# EAGLE design teensyShield1.9 (EAGLE 7.7.0)
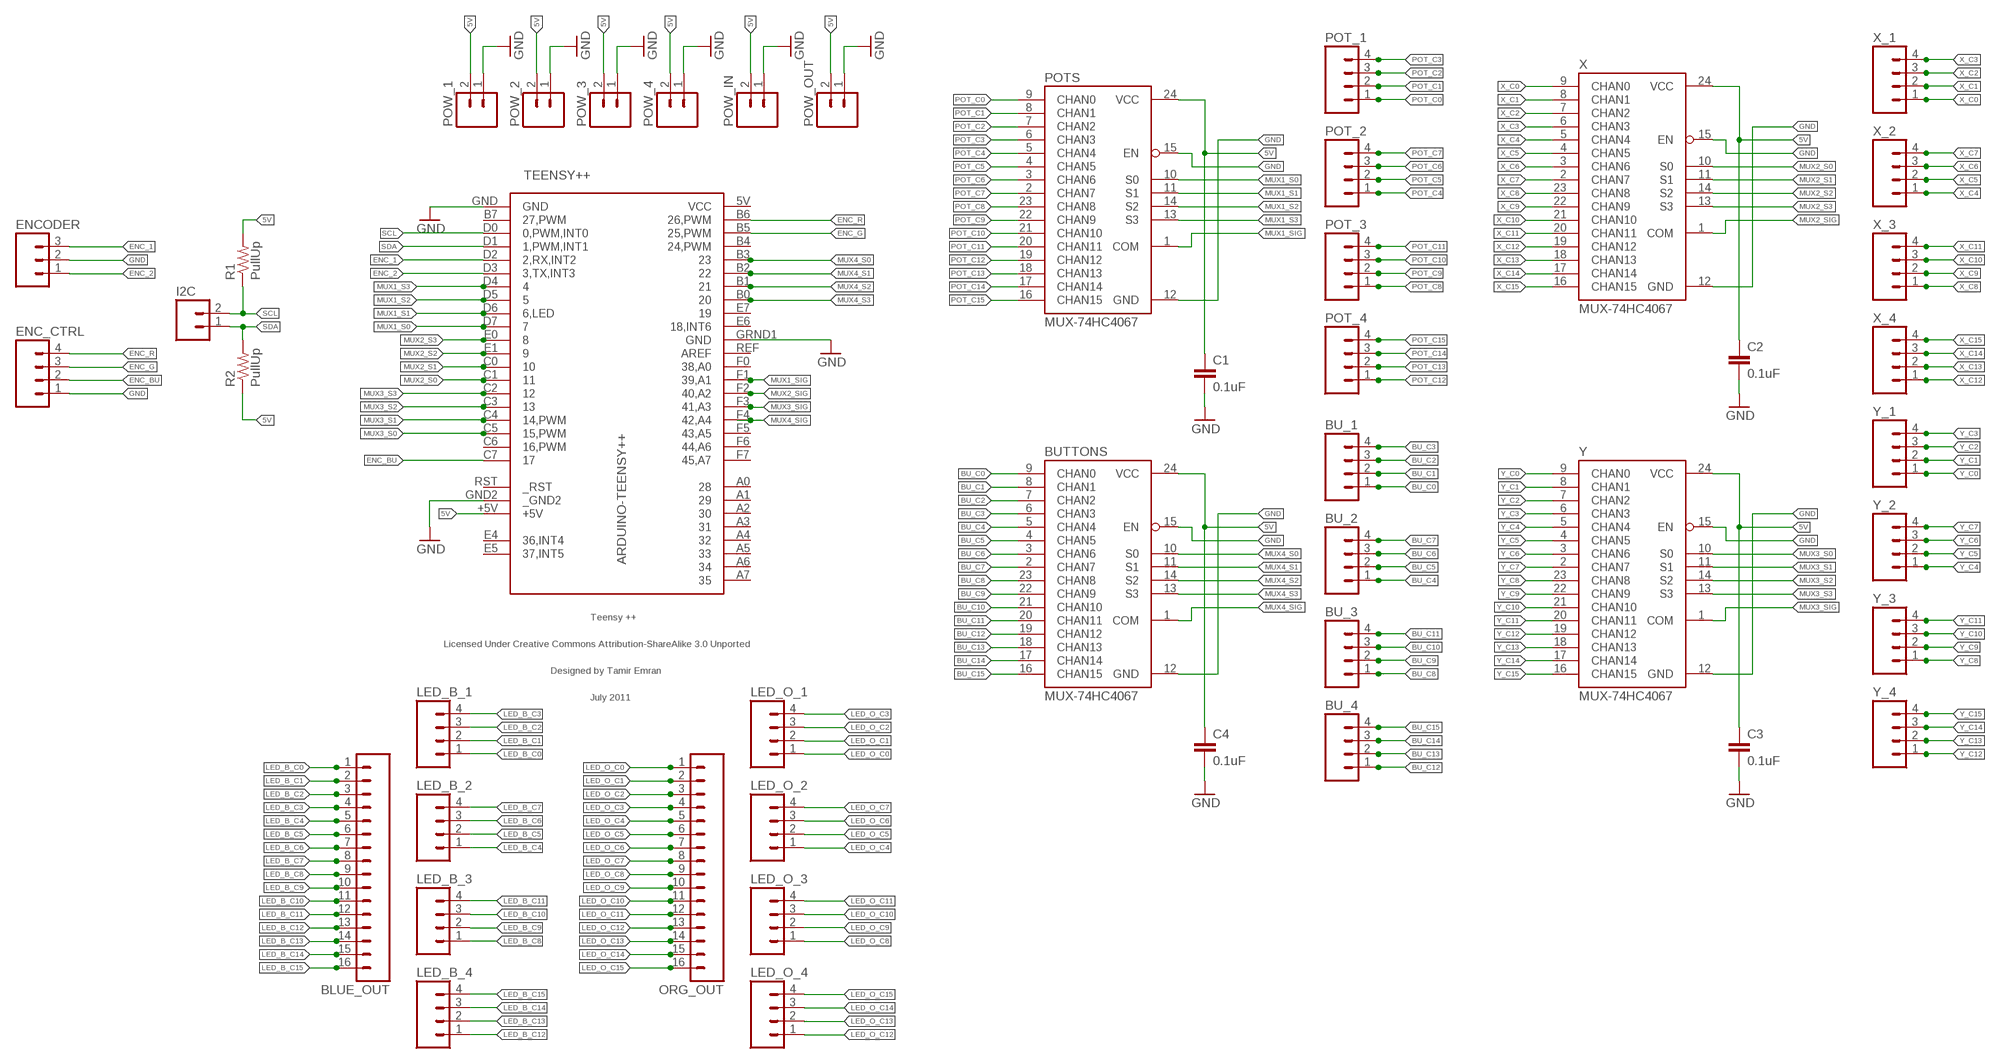
[diagram p0: schematic, sheet 1]

## Parts
BLUE_OUT  M161X16_NO_SILK  [1X16_NO_SILK]
BU_1  M04NO_SILK_ALL_ROUND  [1X04_NO_SILK_ALL_ROUND]
BU_2  M04NO_SILK_ALL_ROUND  [1X04_NO_SILK_ALL_ROUND]
BU_3  M04NO_SILK_ALL_ROUND  [1X04_NO_SILK_ALL_ROUND]
BU_4  M04NO_SILK_ALL_ROUND  [1X04_NO_SILK_ALL_ROUND]
BUTTONS  MUX-74HC4067  MUX-74HC4067SMD  [SSOP24]
C1  0.1uF  CAP0603  [0603]
C2  0.1uF  CAP0603  [0603]
C3  0.1uF  CAP0603  [0603]
C4  0.1uF  CAP0603  [0603]
ENC_CTRL  M041X04_NO_SILK  [1X04_NO_SILK]
ENCODER  M031X03_NO_SILK  [1X03_NO_SILK]
I2C  M02LOCK  [1X02_LOCK]
LED_B_1  M04NO_SILK_ALL_ROUND  [1X04_NO_SILK_ALL_ROUND]
LED_B_2  M04NO_SILK_ALL_ROUND  [1X04_NO_SILK_ALL_ROUND]
LED_B_3  M04NO_SILK_ALL_ROUND  [1X04_NO_SILK_ALL_ROUND]
LED_B_4  M04NO_SILK_ALL_ROUND  [1X04_NO_SILK_ALL_ROUND]
LED_O_1  M04NO_SILK_ALL_ROUND  [1X04_NO_SILK_ALL_ROUND]
LED_O_2  M04NO_SILK_ALL_ROUND  [1X04_NO_SILK_ALL_ROUND]
LED_O_3  M04NO_SILK_ALL_ROUND  [1X04_NO_SILK_ALL_ROUND]
LED_O_4  M04NO_SILK_ALL_ROUND  [1X04_NO_SILK_ALL_ROUND]
ORG_OUT  M161X16_NO_SILK  [1X16_NO_SILK]
POT_1  M04NO_SILK_ALL_ROUND  [1X04_NO_SILK_ALL_ROUND]
POT_2  M04NO_SILK_ALL_ROUND  [1X04_NO_SILK_ALL_ROUND]
POT_3  M04NO_SILK_ALL_ROUND  [1X04_NO_SILK_ALL_ROUND]
POT_4  M04NO_SILK_ALL_ROUND  [1X04_NO_SILK_ALL_ROUND]
POTS  MUX-74HC4067  MUX-74HC4067SMD  [SSOP24]
POW_1  M02POLAR  [MOLEX-1X2]
POW_2  M02POLAR  [MOLEX-1X2]
POW_3  M02POLAR  [MOLEX-1X2]
POW_4  M02POLAR  [MOLEX-1X2]
POW_IN  M02POLAR  [MOLEX-1X2]
POW_OUT  M02POLAR  [MOLEX-1X2]
R1  PullUp  10KOHM-1/4W5%(PTH)  [AXIAL-0.3]
R2  PullUp  10KOHM-1/4W5%(PTH)  [AXIAL-0.3]
TEENSY++  ARDUINO-TEENSY++  [TEENSY++]
X  MUX-74HC4067  MUX-74HC4067SMD  [SSOP24]
X_1  M04NO_SILK_ALL_ROUND  [1X04_NO_SILK_ALL_ROUND]
X_2  M04NO_SILK_ALL_ROUND  [1X04_NO_SILK_ALL_ROUND]
X_3  M04NO_SILK_ALL_ROUND  [1X04_NO_SILK_ALL_ROUND]
X_4  M04NO_SILK_ALL_ROUND  [1X04_NO_SILK_ALL_ROUND]
Y  MUX-74HC4067  MUX-74HC4067SMD  [SSOP24]
Y_1  M04NO_SILK_ALL_ROUND  [1X04_NO_SILK_ALL_ROUND]
Y_2  M04NO_SILK_ALL_ROUND  [1X04_NO_SILK_ALL_ROUND]
Y_3  M04NO_SILK_ALL_ROUND  [1X04_NO_SILK_ALL_ROUND]
Y_4  M04NO_SILK_ALL_ROUND  [1X04_NO_SILK_ALL_ROUND]

## Nets
5V: BUTTONS.24(VCC) C1.1 C2.1 C3.1 C4.1 POTS.24(VCC) POW_1.2 POW_2.2 POW_3.2 POW_4.2 POW_IN.2 POW_OUT.2 R1.P$2 R2.P$1 TEENSY++.+5V X.24(VCC) Y.24(VCC)
BU_C0: BU_1.1 BUTTONS.9(CHAN0)
BU_C1: BU_1.2 BUTTONS.8(CHAN1)
BU_C2: BU_1.3 BUTTONS.7(CHAN2)
BU_C3: BU_1.4 BUTTONS.6(CHAN3)
BU_C4: BU_2.1 BUTTONS.5(CHAN4)
BU_C5: BU_2.2 BUTTONS.4(CHAN5)
BU_C6: BU_2.3 BUTTONS.3(CHAN6)
BU_C7: BU_2.4 BUTTONS.2(CHAN7)
BU_C8: BU_3.1 BUTTONS.23(CHAN8)
BU_C9: BU_3.2 BUTTONS.22(CHAN9)
BU_C10: BU_3.3 BUTTONS.21(CHAN10)
BU_C11: BU_3.4 BUTTONS.20(CHAN11)
BU_C12: BU_4.1 BUTTONS.19(CHAN12)
BU_C13: BU_4.2 BUTTONS.18(CHAN13)
BU_C14: BU_4.3 BUTTONS.17(CHAN14)
BU_C15: BU_4.4 BUTTONS.16(CHAN15)
ENC_1: ENCODER.3 TEENSY++.D2(2,RX,INT2)
ENC_2: ENCODER.1 TEENSY++.D3(3,TX,INT3)
ENC_BU: ENC_CTRL.2 TEENSY++.C7
ENC_G: ENC_CTRL.3 TEENSY++.B5(25,PWM)
ENC_R: ENC_CTRL.4 TEENSY++.B6(26,PWM)
GND: BUTTONS.12(GND) BUTTONS.15(EN) C1.2 C2.2 C3.2 C4.2 ENC_CTRL.1 ENCODER.2 POTS.12(GND) POTS.15(EN) POW_1.1 POW_2.1 POW_3.1 POW_4.1 POW_IN.1 POW_OUT.1 TEENSY++.GND TEENSY++.GND2(_GND2) TEENSY++.GRND1(GND) X.12(GND) X.15(EN) Y.12(GND) Y.15(EN)
LED_B_C0: BLUE_OUT.1 LED_B_1.1
LED_B_C1: BLUE_OUT.2 LED_B_1.2
LED_B_C2: BLUE_OUT.3 LED_B_1.3
LED_B_C3: BLUE_OUT.4 LED_B_1.4
LED_B_C4: BLUE_OUT.5 LED_B_2.1
LED_B_C5: BLUE_OUT.6 LED_B_2.2
LED_B_C6: BLUE_OUT.7 LED_B_2.3
LED_B_C7: BLUE_OUT.8 LED_B_2.4
LED_B_C8: BLUE_OUT.9 LED_B_3.1
LED_B_C9: BLUE_OUT.10 LED_B_3.2
LED_B_C10: BLUE_OUT.11 LED_B_3.3
LED_B_C11: BLUE_OUT.12 LED_B_3.4
LED_B_C12: BLUE_OUT.13 LED_B_4.1
LED_B_C13: BLUE_OUT.14 LED_B_4.2
LED_B_C14: BLUE_OUT.15 LED_B_4.3
LED_B_C15: BLUE_OUT.16 LED_B_4.4
LED_O_C0: LED_O_1.1 ORG_OUT.1
LED_O_C1: LED_O_1.2 ORG_OUT.2
LED_O_C2: LED_O_1.3 ORG_OUT.3
LED_O_C3: LED_O_1.4 ORG_OUT.4
LED_O_C4: LED_O_2.1 ORG_OUT.5
LED_O_C5: LED_O_2.2 ORG_OUT.6
LED_O_C6: LED_O_2.3 ORG_OUT.7
LED_O_C7: LED_O_2.4 ORG_OUT.8
LED_O_C8: LED_O_3.1 ORG_OUT.9
LED_O_C9: LED_O_3.2 ORG_OUT.10
LED_O_C10: LED_O_3.3 ORG_OUT.11
LED_O_C11: LED_O_3.4 ORG_OUT.12
LED_O_C12: LED_O_4.1 ORG_OUT.13
LED_O_C13: LED_O_4.2 ORG_OUT.14
LED_O_C14: LED_O_4.3 ORG_OUT.15
LED_O_C15: LED_O_4.4 ORG_OUT.16
MUX1_S0: POTS.10(S0) TEENSY++.D7
MUX1_S1: POTS.11(S1) TEENSY++.D6(6,LED)
MUX1_S2: POTS.14(S2) TEENSY++.D5
MUX1_S3: POTS.13(S3) TEENSY++.D4
MUX1_SIG: POTS.1(COM) TEENSY++.F1(39,A1)
MUX2_S0: TEENSY++.C1 X.10(S0)
MUX2_S1: TEENSY++.C0 X.11(S1)
MUX2_S2: TEENSY++.E1 X.14(S2)
MUX2_S3: TEENSY++.E0 X.13(S3)
MUX2_SIG: TEENSY++.F2(40,A2) X.1(COM)
MUX3_S0: TEENSY++.C5(15,PWM) Y.10(S0)
MUX3_S1: TEENSY++.C4(14,PWM) Y.11(S1)
MUX3_S2: TEENSY++.C3 Y.14(S2)
MUX3_S3: TEENSY++.C2 Y.13(S3)
MUX3_SIG: TEENSY++.F3(41,A3) Y.1(COM)
MUX4_S0: BUTTONS.10(S0) TEENSY++.B3
MUX4_S1: BUTTONS.11(S1) TEENSY++.B2
MUX4_S2: BUTTONS.14(S2) TEENSY++.B1
MUX4_S3: BUTTONS.13(S3) TEENSY++.B0
MUX4_SIG: BUTTONS.1(COM) TEENSY++.F4(42,A4)
POT_C0: POT_1.1 POTS.9(CHAN0)
POT_C1: POT_1.2 POTS.8(CHAN1)
POT_C2: POT_1.3 POTS.7(CHAN2)
POT_C3: POT_1.4 POTS.6(CHAN3)
POT_C4: POT_2.1 POTS.5(CHAN4)
POT_C5: POT_2.2 POTS.4(CHAN5)
POT_C6: POT_2.3 POTS.3(CHAN6)
POT_C7: POT_2.4 POTS.2(CHAN7)
POT_C8: POT_3.1 POTS.23(CHAN8)
POT_C9: POT_3.2 POTS.22(CHAN9)
POT_C10: POT_3.3 POTS.21(CHAN10)
POT_C11: POT_3.4 POTS.20(CHAN11)
POT_C12: POT_4.1 POTS.19(CHAN12)
POT_C13: POT_4.2 POTS.18(CHAN13)
POT_C14: POT_4.3 POTS.17(CHAN14)
POT_C15: POT_4.4 POTS.16(CHAN15)
SCL: I2C.2 R1.P$1 TEENSY++.D0(0,PWM,INT0)
SDA: I2C.1 R2.P$2 TEENSY++.D1(1,PWM,INT1)
X_C0: X.9(CHAN0) X_1.1
X_C1: X.8(CHAN1) X_1.2
X_C2: X.7(CHAN2) X_1.3
X_C3: X.6(CHAN3) X_1.4
X_C4: X.5(CHAN4) X_2.1
X_C5: X.4(CHAN5) X_2.2
X_C6: X.3(CHAN6) X_2.3
X_C7: X.2(CHAN7) X_2.4
X_C8: X.23(CHAN8) X_3.1
X_C9: X.22(CHAN9) X_3.2
X_C10: X.21(CHAN10) X_3.3
X_C11: X.20(CHAN11) X_3.4
X_C12: X.19(CHAN12) X_4.1
X_C13: X.18(CHAN13) X_4.2
X_C14: X.17(CHAN14) X_4.3
X_C15: X.16(CHAN15) X_4.4
Y_C0: Y.9(CHAN0) Y_1.1
Y_C1: Y.8(CHAN1) Y_1.2
Y_C2: Y.7(CHAN2) Y_1.3
Y_C3: Y.6(CHAN3) Y_1.4
Y_C4: Y.5(CHAN4) Y_2.1
Y_C5: Y.4(CHAN5) Y_2.2
Y_C6: Y.3(CHAN6) Y_2.3
Y_C7: Y.2(CHAN7) Y_2.4
Y_C8: Y.23(CHAN8) Y_3.1
Y_C9: Y.22(CHAN9) Y_3.2
Y_C10: Y.21(CHAN10) Y_3.3
Y_C11: Y.20(CHAN11) Y_3.4
Y_C12: Y.19(CHAN12) Y_4.1
Y_C13: Y.18(CHAN13) Y_4.2
Y_C14: Y.17(CHAN14) Y_4.3
Y_C15: Y.16(CHAN15) Y_4.4
Unconnected: TEENSY++.A0 TEENSY++.A1 TEENSY++.A2 TEENSY++.A3 TEENSY++.A4 TEENSY++.A5 TEENSY++.A6 TEENSY++.A7 TEENSY++.B4(24,PWM) TEENSY++.B7(27,PWM) TEENSY++.C6(16,PWM) TEENSY++.E4(36,INT4) TEENSY++.E5(37,INT5) TEENSY++.E6(18,INT6) TEENSY++.E7 TEENSY++.F0(38,A0) TEENSY++.F5(43,A5) TEENSY++.F6(44,A6) TEENSY++.F7(45,A7) TEENSY++.REF(AREF) TEENSY++.RST(_RST)

## Power pins joined to a net without a drawn wire
VCC: TEENSY++.5V(VCC)

## Library data of the parts
BLUE_OUT ORG_OUT = SparkFun-Connectors:M16: 1x16 .1" header
BU_1-BU_4 ENC_CTRL LED_B_1-LED_B_4 LED_O_1-LED_O_4 POT_1-POT_4 X_1-X_4 Y_1-Y_4 = SparkFun-Connectors:M04: Header 4 Standard 4-pin 0.1" header. Use with straight break away headers (SKU : PRT-00116), right angle break away headers (PRT-00553), swiss pins (PRT-00743), machine pins (PRT-00117), and female headers (PRT-00115). Molex polarized connector foot print use with SKU : PRT-08231 with associated crimp pins and housings. 1MM SMD Version SKU: PRT-10208; PROD_ID: CONN-09696
BUTTONS POTS X Y = SparkFun:MUX-74HC4067
C1-C4 = SparkFun:CAP: Capacitor Standard 0603 ceramic capacitor, and 0.1" leaded capacitor.
ENCODER = SparkFun-Connectors:M03: Header 3 Standard 3-pin 0.1" header. Use with straight break away headers (SKU : PRT-00116), right angle break away headers (PRT-00553), swiss pins (PRT-00743), machine pins (PRT-00117), and female headers (PRT-00115). Molex polarized connector foot print use with SKU : PRT-08232 with associated crimp pins and housings.
I2C POW_1-POW_4 POW_IN POW_OUT = SparkFun-Connectors:M02: Standard 2-pin 0.1" header. Use with - straight break away headers ( PRT-00116) - right angle break away headers (PRT-00553) - swiss pins (PRT-00743) - machine pins (PRT-00117) - female headers (PRT-00115) Molex polarized connector foot print use with: PRT-08233 with associated crimp pins and housings. 2.54_SCREWTERM for use with PRT-10571. 3.5mm Screw Terminal footprints for PRT-08084 5mm Screw Terminal footprints for use with PRT-08432
R1 R2 = SparkFun-Resistors:10KOHM-1/4W5%(PTH): RES-09435; PROD_ID: RES-9435; VALUE: 10k
TEENSY++ = teensypp:ARDUINO-TEENSY++: Teensy ++ Original Design by Mark Gross Modified Design by Tamir Emran Licensed Under Creative Commons Attribution-ShareAlike 3.0 Unported (CC BY-SA 3.0)

## Board
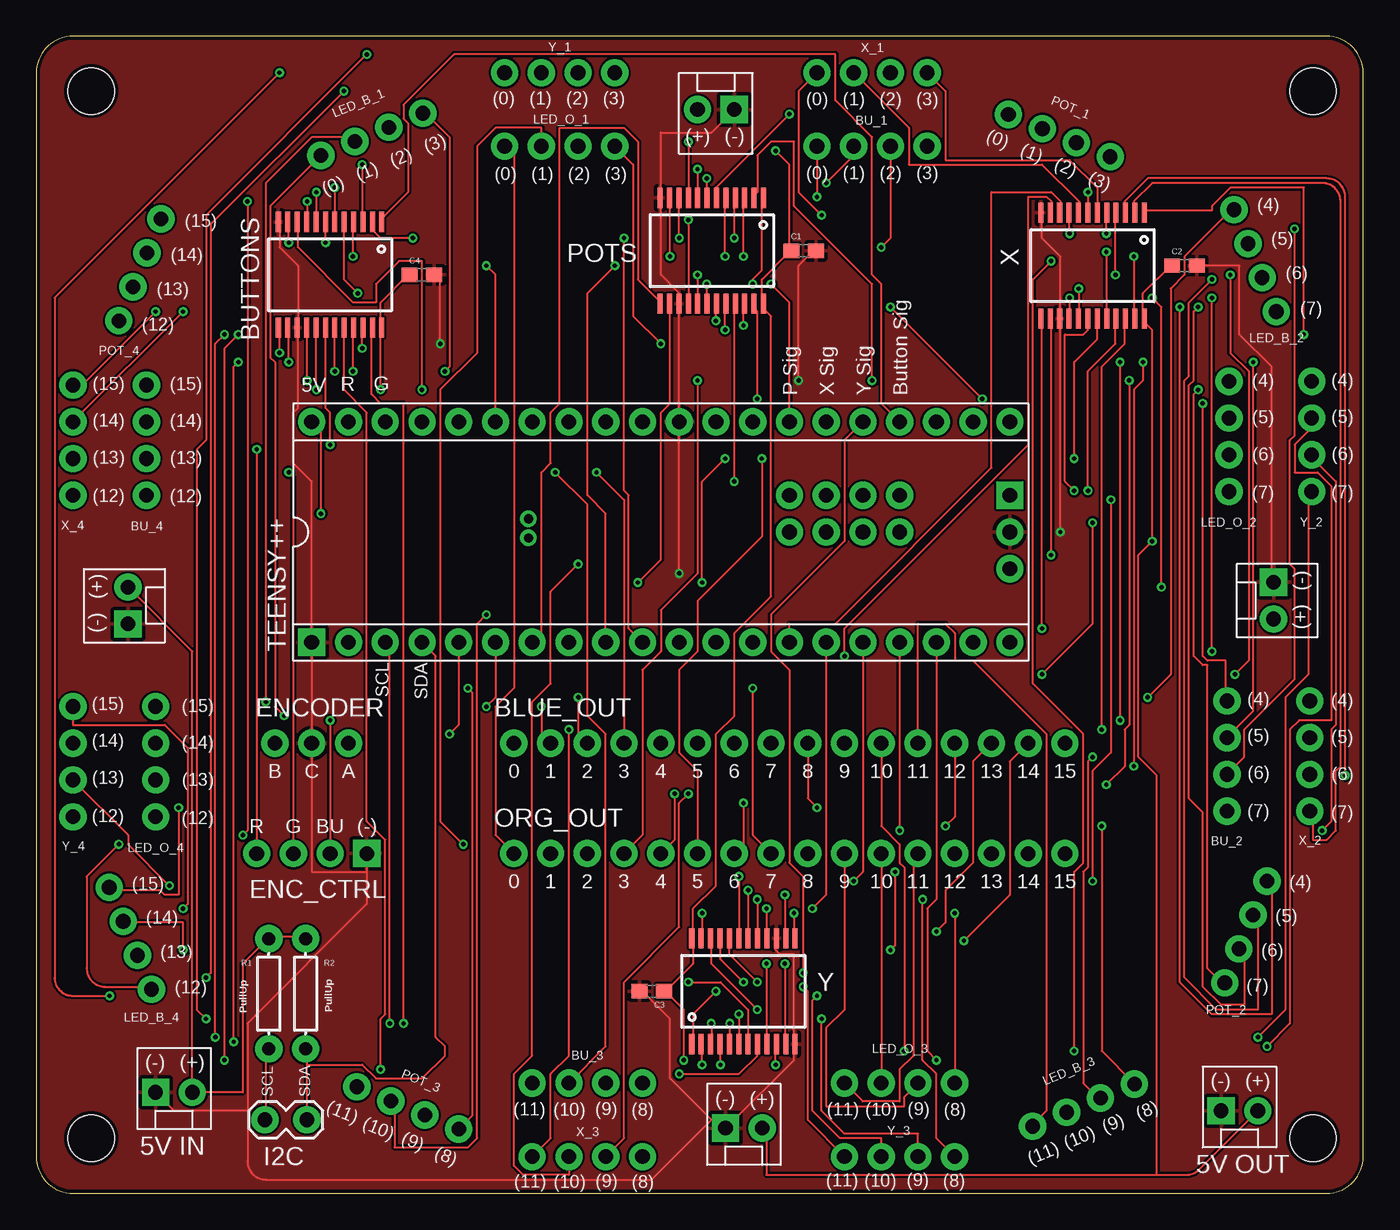
[diagram p1: board, top side]
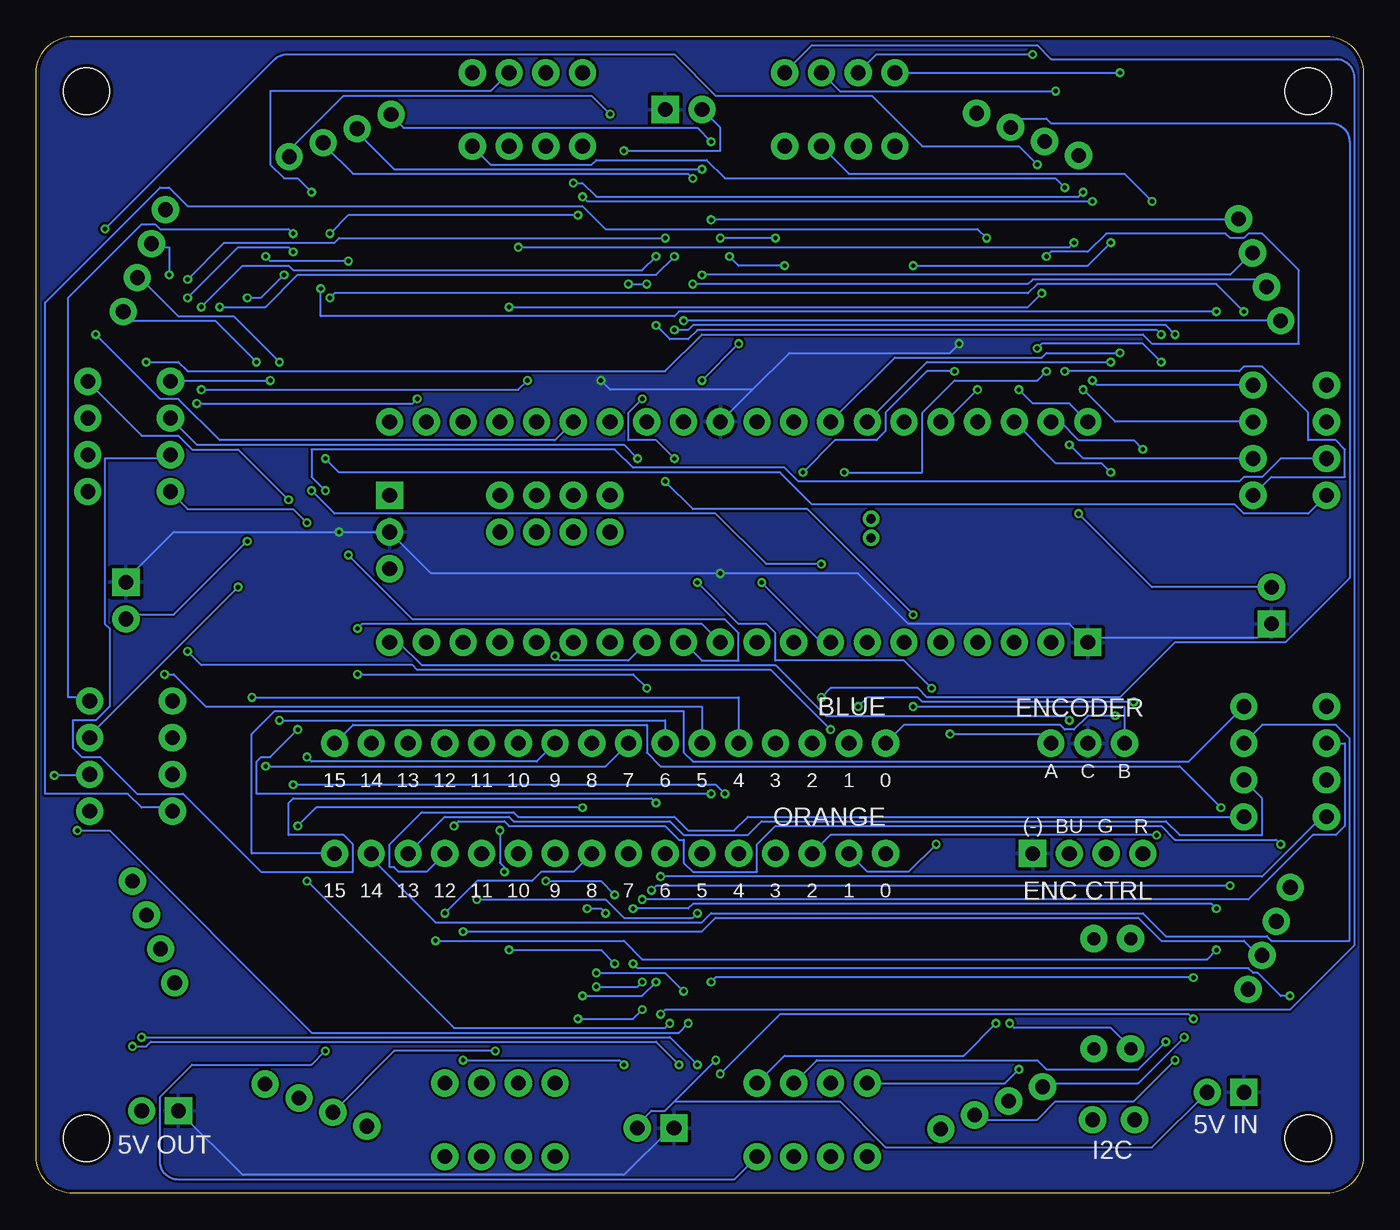
[diagram p2: board, bottom side, seen from below]

Size 91.75 x 80 mm. Coordinates in mm from the lower left corner, seen from the top.
Outline: 2.54,0 89.2,0 arc90 91.75,2.54 91.75,77.46 arc90 89.2,80 2.54,80 arc90 0,77.46 0,2.54 arc90 2.54,0
Copper layers (1*16): Top 0.035mm / dielectric 1.5mm / Bottom 0.035mm
Design rules "SeeedStudio_2layer_DRU_no_angle_20140221": minimum track width 6mil, minimum drill 12mil, track to track 6mil, track to pad 6mil, pad to pad 6mil, via to via 6mil, smd to smd 0mil, copper to edge 10mil, drill to drill 10mil, minimum pad ring 10mil, minimum via ring 6mil, stop-mask expansion 2mil, vias tented up to drill 100mil, thermal gap 10mil
Holes 3.2 mm at 88.27,3.81 88.27,76.2 3.81,76.2 3.81,3.81

### Footprints (pad centres in the part's own frame; a part is rotated, then mirrored left to right if it is on the bottom)
1X16_NO_SILK = drill 1.016 pad 1.88: 1 0,0; 2 2.54,0; 3 5.08,0; 4 7.62,0; 5 10.16,0; 6 12.7,0; 7 15.24,0; 8 17.78,0; 9 20.32,0; 10 22.86,0; 11 25.4,0; 12 27.94,0; 13 30.48,0; 14 33.02,0; 15 35.56,0; 16 38.1,0
1X04_NO_SILK_ALL_ROUND = drill 1.016 pad 1.88: 1 0,0; 2 2.54,0; 3 5.08,0; 4 7.62,0
SSOP24 = smd 0.348 x 1.397: 1 -3.575,-3.656; 2 -2.925,-3.656; 3 -2.275,-3.656; 4 -1.625,-3.656; 5 -0.975,-3.656; 6 -0.325,-3.656; 7 0.325,-3.656; 8 0.975,-3.656; 9 1.625,-3.656; 10 2.275,-3.656; 11 2.925,-3.656; 12 3.575,-3.656; 13 3.575,3.656; 14 2.925,3.656; 15 2.275,3.656; 16 1.625,3.656; 17 0.975,3.656; 18 0.325,3.656; 19 -0.325,3.656; 20 -0.975,3.656; 21 -1.625,3.656; 22 -2.275,3.656; 23 -2.925,3.656; 24 -3.575,3.656
0603 = smd 1.1 x 1: 1 -0.85,0; 2 0.85,0
1X04_NO_SILK = drill 1.016 pad 1.88 square: 1 0,0 | drill 1.016 pad 1.88: 2 2.54,0; 3 5.08,0; 4 7.62,0
1X03_NO_SILK = drill 1.016 pad 1.88: 1 0,0; 2 2.54,0; 3 5.08,0
1X02_LOCK = drill 1.016 pad 1.88: 1 -0.178,0; 2 2.718,0
MOLEX-1X2 = drill 1.016 pad 1.88 square: 1 0,0 | drill 1.016 pad 1.88: 2 2.54,0
AXIAL-0.3 = drill 0.9 pad 1.88: P$1 -3.81,0; P$2 3.81,0
TEENSY++ = drill 1.016 pad 1.88: 5V 24.13,-2.54; +5V -24.13,7.62; A0 8.89,0; A1 11.43,0; A2 13.97,0; A3 16.51,0; A4 8.89,2.54; A5 11.43,2.54; A6 13.97,2.54; A7 16.51,2.54; B0 -6.35,7.62; B1 -8.89,7.62; B2 -11.43,7.62; B3 -13.97,7.62; B4 -16.51,7.62; B5 -19.05,7.62; B6 -21.59,7.62; B7 -21.59,-7.62; C0 6.35,-7.62; C1 8.89,-7.62; C2 11.43,-7.62; C3 13.97,-7.62; C4 16.51,-7.62; C5 19.05,-7.62; C6 21.59,-7.62; C7 24.13,-7.62; D0 -19.05,-7.62; D1 -16.51,-7.62; D2 -13.97,-7.62; D3 -11.43,-7.62; D4 -8.89,-7.62; D5 -6.35,-7.62; D6 -3.81,-7.62; D7 -1.27,-7.62; E0 1.27,-7.62; E1 3.81,-7.62; E6 -1.27,7.62; E7 -3.81,7.62; F0 6.35,7.62; F1 8.89,7.62; F2 11.43,7.62; F3 13.97,7.62; F4 16.51,7.62; F5 19.05,7.62; F6 21.59,7.62; F7 24.13,7.62; GND2 24.13,0; GRND1 1.27,7.62; REF 3.81,7.62 | drill 0.635 pad 1.067: E4 -9.144,0.914; E5 -9.144,-0.406 | drill 1.016 pad 1.88 square: GND -24.13,-7.62; RST 24.13,2.54

### Placement (x,y rotation side)
BLUE_OUT  33.02,31.11 0 top
BU_1  53.98,72.39 0 top
BU_2  82.33,34.04 270 top
BU_3  41.91,7.62 180 top
BU_4  7.62,48.26 90 top
BUTTONS  20.32,63.5 180 top
C1  53.06,65.17 0 top
C2  79.38,64.14 0 top
C3  42.55,13.97 180 top
C4  26.67,63.5 0 top
ENC_CTRL  22.86,23.5 180 top
ENCODER  16.51,31.11 0 top
I2C  18.54,5.09 180 top
LED_B_1  19.68,71.75 22.5 top
LED_B_2  82.81,68 292.5 top
LED_B_3  75.92,7.56 202.5 top
LED_B_4  7.97,14.11 112.5 top
LED_O_1  32.38,72.39 0 top
LED_O_2  82.46,56.13 270 top
LED_O_3  63.5,7.62 180 top
LED_O_4  8.26,26.04 90 top
ORG_OUT  33.02,23.5 0 top
POT_1  67.21,74.58 337.5 top
POT_2  85.09,21.59 247.5 top
POT_3  29.21,4.45 157.5 top
POT_4  5.71,60.33 67.5 top
POTS  46.71,65.17 180 top
POW_1  6.35,39.37 90 top
POW_2  48.26,74.93 180 top
POW_3  85.54,42.25 270 top
POW_4  47.65,4.52 0 top
POW_IN  8.26,6.99 0 top
POW_OUT  81.92,5.71 0 top
R1  16.09,13.8 90 top
R2  18.63,13.8 270 top
TEENSY++  43.18,45.72 0 top
X  73.03,64.14 180 top
X_1  53.98,77.47 0 top
X_2  88.04,34.04 270 top
X_3  41.91,2.54 180 top
X_4  2.54,48.26 90 top
Y  48.9,13.97 0 top
Y_1  32.38,77.47 0 top
Y_2  88.17,56.13 270 top
Y_3  63.5,2.54 180 top
Y_4  2.54,26.04 90 top

### Tracks (layer width: path | path; a pad name or v marks a point on that pad's centre or on a via)
5V  (via drill 0.3)
  Top 0.152: C4.1 25.72,63.5 23.81,61.59 23.81,60.01 BUTTONS.24 23.81,59.69 v23.81,55.56 | R2.P$1 18.41,17.78 16.19,17.78 R1.P$2 15.88,17.46 14.29,15.88 14.29,6.99 POW_IN.2 10.79,37.47 POW_1.2 | TEENSY++.+5V 19.68,52.7 v19.68,46.99 | C2.1 78.42,64.14 76.52,62.23 76.52,60.64 X.24 76.52,60.33 77.15,59.69 v77.15,45.09 76.2,44.13 76.2,30.16 77.47,28.89 77.47,1.27 | 43.5,13.97 45.4,15.88 45.4,17.46 Y.24 45.4,17.78 45.4,19.68 46.99,21.27 46.99,31.75 48.26,33.02 48.26,38.73 50.8,41.27 50.8,60.64 50.16,61.28 POTS.24 50.16,61.59 50.16,63.18 52.07,65.09 C1.1 52.07,65.41 52.07,71.12 v51.12,72.07 | 43.5,13.97 44.77,12.7 v44.77,9.21 | 43.5,13.97 C3.1 | 77.47,1.27 79.48,1.27 arc45 80.38,1.64 POW_OUT.2 | 77.47,1.27 50.48,1.27 50.48,4.45 POW_4.2
  Bottom 0.152: v23.81,55.56 22.86,54.61 20.32,54.61 TEENSY++.+5V | v19.68,46.99 14.61,41.91 POW_1.2 | v77.15,45.09 82.23,40.01 85.41,40.01 POW_3.2 | 47.62,6.35 48.26,5.71 49.21,5.71 50.16,4.76 POW_4.2 | 47.62,6.35 v44.77,9.21 | POW_2.2 44.45,73.66 44.45,72.07 v51.12,72.07 | POW_IN.2 14.61,3.17 33.02,3.17 36.2,6.35 47.62,6.35
BU_C0  (via drill 0.3)
  Top 0.152: v18.73,68.58 18.73,67.31 BUTTONS.9 | BU_1.1 v53.98,68.9
  Bottom 0.152: v18.73,68.58 53.66,68.58 v53.98,68.9
BU_C1  (via drill 0.3)
  Top 0.152: v19.37,69.22 19.37,67.31 BUTTONS.8 | v54.61,69.85 56.52,71.75 BU_1.2
  Bottom 0.152: v19.37,69.22 19.68,68.9 53.02,68.9 53.98,69.85 v54.61,69.85
BU_C2  (via drill 0.3)
  Top 0.152: v20,65.72 20,66.99 BUTTONS.7 | v58.42,65.41 59.05,66.04 BU_1.3
  Bottom 0.152: v20,65.72 20.32,65.41 v58.42,65.41
BU_C3  (via drill 0.3)
  Top 0.152: v20.64,69.53 20.64,67.31 BUTTONS.6
  Bottom 0.152: v20.64,69.53 21.27,70.17 44.13,70.17 45.4,71.44 53.02,71.44 53.34,71.12 60.33,71.12 BU_1.4
BU_C4  (via drill 0.3)
  Top 0.152: v22.23,62.23 21.27,63.18 21.27,66.99 BUTTONS.5 | v65.41,54.93 v59.05,61.28 | v80.64,54.61 80.64,37.15 80.96,36.83 82.23,36.83 82.23,34.29 BU_2.1
  Bottom 0.152: v22.23,62.23 23.18,61.28 v59.05,61.28 | v65.41,54.93 65.72,54.61 v80.64,54.61
BU_C5  (via drill 0.3)
  Top 0.152: v21.91,64.77 21.91,66.99 BUTTONS.4 | v84.14,57.47 84.14,33.34 82.55,31.75 BU_2.2
  Bottom 0.152: v21.91,64.77 21.59,65.09 19.05,65.09 17.78,66.36 9.53,66.36 9.21,66.04 8.26,66.04 7.94,66.36 6.99,66.36 4.45,63.82 4.45,58.74 14.61,58.74 15.24,59.37 45.72,59.37 48.26,56.83 81.28,56.83 81.92,57.47 v84.14,57.47
BU_C6  (via drill 0.3)
  Top 0.152: v22.54,71.12 22.54,67.31 BUTTONS.3 | v87,66.67 87,52.39 86.68,52.07 86.68,43.5 87,43.18 87,35.56 83.5,32.07 83.5,30.16 82.55,29.21 BU_2.3
  Bottom 0.152: v22.54,71.12 23.81,72.39 30.48,72.39 33.97,75.88 44.77,75.88 47.62,78.74 74.4,78.74 arc-45 75.3,78.37 v87,66.67
BU_C7  (via drill 0.3)
  Top 0.152: v26.04,66.04 23.81,66.04 23.18,66.67 23.18,66.99 BUTTONS.2
  Bottom 0.152: v26.04,66.04 26.67,66.67 52.39,66.67 53.98,68.26 81.28,68.26 82.55,69.53 83.19,69.53 91.12,61.59 91.12,27.62 85.41,27.62 84.45,26.67 82.55,26.67 BU_2.4
BU_C8  (via drill 0.3)
  Top 0.152: v25.4,11.75 25.4,54.61 23.81,54.61 23.18,55.24 23.18,59.69 BUTTONS.23
  Bottom 0.152: v25.4,11.75 27.62,9.53 40.01,9.53 BU_3.1
BU_C9  (via drill 0.3)
  Top 0.152: v22.54,58.42 22.54,59.69 BUTTONS.22 | v13.97,57.47 13.65,57.15 v13.65,10.48
  Bottom 0.152: v22.54,58.42 22.23,58.74 15.24,58.74 v13.97,57.47 | v13.65,10.48 15.56,8.57 21.91,8.57 22.54,9.21 37.78,9.21 BU_3.2
BU_C10  (via drill 0.3)
  Top 0.152: v21.91,56.83 21.91,59.69 BUTTONS.21 | v35.88,49.85 38.1,47.62 38.1,33.02 39.37,31.75 39.37,10.16 BU_3.3
  Bottom 0.152: v21.91,56.83 22.54,56.2 28.26,56.2 30.48,53.98 30.48,49.85 v35.88,49.85
BU_C11  (via drill 0.3)
  Top 0.152: v23.81,8.57 23.81,12.06 24.13,12.38 24.13,24.45 22.86,25.72 22.86,53.98 21.27,55.56 21.27,59.69 BUTTONS.20
  Bottom 0.152: v23.81,8.57 24.77,7.62 BU_3.4
BU_C12  (via drill 0.3)
  Top 0.152: v20.64,56.83 20.64,59.69 BUTTONS.19
  Bottom 0.152: v20.64,56.83 8.57,56.83 8.26,57.15 6.99,57.15 3.81,53.98 3.81,52.07 1.91,52.07 1.27,51.44 1.27,49.53 6.35,49.53 BU_4.1
BU_C13  (via drill 0.3)
  Top 0.152: v20.32,51.75 20.32,53.98 20,54.29 20,59.69 BUTTONS.18
  Bottom 0.152: v20.32,51.75 19.37,50.8 BU_4.2
BU_C14  (via drill 0.3)
  Top 0.152: v19.37,55.56 19.37,59.69 BUTTONS.17
  Bottom 0.152: v19.37,55.56 17.14,53.34 BU_4.3
BU_C15  (via drill 0.3)
  Top 0.152: v18.73,56.2 18.73,59.69 BUTTONS.16
  Bottom 0.152: v18.73,56.2 18.41,55.88 BU_4.4
ENC_1  (via drill 0.3)
  Top 0.152: v28.57,31.75 29.21,32.38 TEENSY++.D2
  Bottom 0.152: ENCODER.3 22.23,31.75 v28.57,31.75
ENC_2  (via drill 0.3)
  Top 0.152: v31.11,33.66 31.75,34.29 TEENSY++.D3
  Bottom 0.152: ENCODER.1 16.51,33.66 v31.11,33.66
ENC_BU  (via drill 0.3)
  Top 0.152: v20.32,32.7 ENC_CTRL.2
  Bottom 0.152: v20.32,32.7 20.64,33.02 37.15,33.02 40.64,36.51 65.09,36.51 66.67,38.1 TEENSY++.C7
ENC_G  (via drill 0.3)
  Top 0.152: ENC_CTRL.3 17.78,49.53 v17.46,49.85
  Bottom 0.152: v17.46,49.85 18.1,50.48 21.27,50.48 TEENSY++.B5
ENC_R  (via drill 0.3)
  Top 0.152: v15.24,51.44 ENC_CTRL.4
  Bottom 0.152: v15.24,51.44 15.88,52.07 19.68,52.07 20.95,53.34 TEENSY++.B6
GND  (via drill 0.3)
  Top 0.152: 46.67,5.08 46.99,4.76 47.62,4.76 POW_4.1 47.94,4.76 52.39,9.21 52.39,10.16 Y.12 52.39,10.48 52.39,16.51 51.44,16.51 51.12,16.83 51.12,17.46 Y.15 | 46.67,5.08 43.81,7.94 43.81,12.06 41.91,13.97 C3.2 | v27.94,58.74 27.94,63.18 27.62,63.5 C4.2 | v52.7,56.2 52.7,64.14 53.66,65.09 C1.2 | POW_2.1 46.67,73.34 43.18,73.34 43.18,68.9 POTS.12 43.18,68.58 43.18,63.5 44.45,62.23 44.45,61.59 POTS.15 44.45,61.28 TEENSY++.GRND1 v44.45,42.86 | X.12 69.53,67.63 69.53,66.04 70.8,64.77 70.8,60.64 X.15 70.8,60.33 v70.8,45.72 | C2.2 83.19,64.14 83.19,59.37 85.41,57.15 85.41,42.55 POW_3.1 | POW_IN.1 9.53,5.71 14.61,5.71 | 14.61,5.71 14.61,11.75 22.86,20 22.86,22.23 | ENC_CTRL.1 22.86,22.23 | BUTTONS.12 16.83,66.99 16.83,65.41 18.1,64.14 18.1,60.01 BUTTONS.15 18.1,59.69 18.1,54.29 17.78,53.98 17.78,50.48 19.05,49.21 TEENSY++.GND ENCODER.2 19.05,22.23 22.86,22.23 | 46.67,5.08 42.55,0.95 15.88,0.95 arc-90 14.61,2.22 14.61,5.71
  Bottom 0.152: POW_OUT.1 77.47,1.27 51.12,1.27 47.94,4.45 POW_4.1 | v27.94,58.74 28.57,58.1 39.69,58.1 42.23,55.56 | TEENSY++.GRND1 42.23,55.56 | v52.7,56.2 52.07,55.56 42.23,55.56 | POW_3.1 85.41,42.55 82.23,45.72 v70.8,45.72 TEENSY++.GND2 64.45,42.86 v44.45,42.86 34.92,42.86 31.43,39.37 20.32,39.37 TEENSY++.GND 18.73,38.42 7.3,38.42 POW_1.1
  pour Top: 0,-0.64 92.08,-0.64 92.08,80.01 0,80.01
  pour Bottom: 0,0 92.08,0 92.08,80.01 0,80.01
LED_B_C0  (via drill 0.3)
  Top 0.152: v17.14,33.02 16.51,33.66 16.51,57.47 16.19,57.78 16.19,68.26 LED_B_1.1
  Bottom 0.152: BLUE_OUT.1 31.75,32.38 20.95,32.38 20.64,32.07 20,32.07 19.05,33.02 v17.14,33.02
LED_B_C1  (via drill 0.3)
  Top 0.152: BLUE_OUT.2 34.92,31.75 v34.92,33.66 | v15.88,33.97 15.88,69.85 19.05,73.03 21.91,73.03 LED_B_1.2
  Bottom 0.152: v34.92,33.66 34.29,34.29 30.8,34.29 30.48,33.97 v15.88,33.97
LED_B_C2  (via drill 0.3)
  Top 0.152: BLUE_OUT.3 37.47,31.75 v37.47,34.29
  Bottom 0.152: v37.47,34.29 36.83,34.92 30.8,34.92 30.16,34.29 16.83,34.29 13.02,38.1 5.4,38.1 0.95,42.55 0.95,72.71 arc-90 2.22,73.98 21.59,73.98 21.91,74.3 23.81,74.3 24.13,73.98 LED_B_1.3
LED_B_C3  (via drill 0.3)
  Top 0.152: BLUE_OUT.4 40.64,47.94 v38.73,49.85 | v28.26,56.83 28.57,57.15 28.57,73.03 26.99,74.61 LED_B_1.4
  Bottom 0.152: v38.73,49.85 36.51,52.07 33.66,52.07 33.02,52.7 33.02,53.98 30.16,56.83 v28.26,56.83
LED_B_C4  (via drill 0.3)
  Top 0.152: v76.83,34.29 78.42,35.88 78.42,62.55 79.38,63.5 79.38,64.77 82.55,67.94 LED_B_2.1
  Bottom 0.152: BLUE_OUT.5 43.18,34.29 v76.83,34.29
LED_B_C5  (via drill 0.3)
  Top 0.152: v82.87,35.88 83.82,36.83 83.82,56.83 82.55,58.1 v82.55,63.5
  Bottom 0.152: BLUE_OUT.6 45.72,33.66 80.01,33.66 82.23,35.88 v82.87,35.88 | v82.55,63.5 82.55,65.41 83.5,65.41 LED_B_2.2
LED_B_C6  (via drill 0.3)
  Top 0.152: v74.93,57.47 v74.93,32.7
  Bottom 0.152: BLUE_OUT.7 48.26,32.7 v74.93,32.7 | v74.93,57.47 78.11,60.64 81.92,60.64 84.45,63.18 LED_B_2.3
LED_B_C7  (via drill 0.3)
  Top 0.152: v75.88,29.53 75.88,55.56 76.52,56.2 v76.52,57.47
  Bottom 0.152: BLUE_OUT.8 52.39,29.53 v75.88,29.53 | v76.52,57.47 79.38,60.33 85.09,60.33 LED_B_2.4
LED_B_C8  (via drill 0.3)
  Top 0.152: v73.66,25.4 73.66,9.84 75.88,7.62 LED_B_3.1 | v53.98,26.67 53.34,27.3 BLUE_OUT.9
  Bottom 0.152: v73.66,25.4 72.39,26.67 v53.98,26.67
LED_B_C9  (via drill 0.3)
  Top 0.152: v73.03,30.16 72.71,29.84 72.71,22.54 72.39,22.23 72.39,7.62 73.34,6.67 LED_B_3.2
  Bottom 0.152: v73.03,30.16 72.71,29.84 57.15,29.84 BLUE_OUT.10
LED_B_C10  (via drill 0.3)
  Top 0.152: v60.01,9.84 60.01,22.54 59.69,22.86 59.69,24.13 58.42,25.4 BLUE_OUT.11
  Bottom 0.152: v60.01,9.84 66.99,9.84 71.12,5.71 LED_B_3.3
LED_B_C11
  Top 0.152: BLUE_OUT.12 60.96,39.37 62.87,39.37 63.5,38.73 63.5,36.83 64.77,36.83 69.85,31.75 69.85,5.71 68.9,4.76 LED_B_3.4
LED_B_C12  (via drill 0.3)
  Top 0.152: v5.71,24.13 3.49,21.91 3.49,15.56 arc90 4.76,14.29 7.94,14.29 LED_B_4.1 | v62.87,25.4 63.5,26.04 BLUE_OUT.13
  Bottom 0.152: v5.71,24.13 6.03,24.45 13.02,24.45 13.97,25.4 40.64,25.4 41.91,24.13 41.91,22.23 46.35,22.23 46.99,22.86 46.99,24.45 47.31,24.45 48.26,25.4 59.05,25.4 59.37,25.72 62.55,25.72 v62.87,25.4
LED_B_C13  (via drill 0.3)
  Top 0.152: v62.23,18.1 62.87,18.73 62.87,20.95 64.77,22.86 64.77,29.84 BLUE_OUT.14
  Bottom 0.152: v62.23,18.1 45.72,18.1 44.77,19.05 15.56,19.05 13.97,17.46 8.26,17.46 7.3,16.51 LED_B_4.2
LED_B_C14  (via drill 0.3)
  Top 0.152: v10.16,16.83 10.16,18.73 6.03,18.73 LED_B_4.3 | v64.14,17.46 67.31,20.64 67.31,29.84 BLUE_OUT.15
  Bottom 0.152: v10.16,16.83 10.79,16.19 49.85,16.19 51.12,17.46 v64.14,17.46
LED_B_C15  (via drill 0.3)
  Top 0.152: v9.84,26.67 9.84,20.64 8.89,20.64 8.57,20.95 5.08,20.95 LED_B_4.4
  Bottom 0.152: v9.84,26.67 12.7,29.53 48.58,29.53 49.53,30.48 49.53,32.38 69.85,32.38 BLUE_OUT.16
LED_O_C0
  Top 0.152: ORG_OUT.1 31.75,24.77 31.75,33.66 33.02,34.92 33.02,71.75 LED_O_1.1
LED_O_C1  (via drill 0.3)
  Top 0.152: v29.53,24.13 27.94,25.72 27.94,55.56 30.48,58.1 30.48,72.39 31.75,73.66 34.92,73.66 LED_O_1.2
  Bottom 0.152: ORG_OUT.2 34.29,22.23 31.43,22.23 v29.53,24.13
LED_O_C2  (via drill 0.3)
  Top 0.152: v14.29,24.77 14.61,25.08 v14.61,68.58
  Bottom 0.152: ORG_OUT.3 36.83,24.77 v14.29,24.77 | v14.61,68.58 16.51,70.48 35.56,70.48 LED_O_1.3
LED_O_C3  (via drill 0.3)
  Top 0.152: ORG_OUT.4 41.91,24.77 41.91,36.2 43.18,37.47 43.18,40.32 45.72,42.86 v45.72,56.2 | v43.18,58.74 41.27,60.64 41.27,71.12 LED_O_1.4
  Bottom 0.152: v43.18,58.74 v45.72,56.2
LED_O_C4  (via drill 0.3)
  Top 0.152: ORG_OUT.5 44.13,24.45 v44.13,27.62 | v73.98,28.26 75.25,29.53 75.25,32.07 75.56,32.38 v75.56,56.2
  Bottom 0.152: v44.13,27.62 44.77,28.26 v73.98,28.26 | v75.56,56.2 82.23,56.2 LED_O_2.1
LED_O_C5  (via drill 0.3)
  Top 0.152: ORG_OUT.6 45.72,29.21 44.45,30.48 44.45,36.2 45.72,37.47 45.72,40.96 50.16,45.4 v50.16,50.8
  Bottom 0.152: v50.16,50.8 51.12,51.75 80.64,51.75 82.23,53.34 LED_O_2.2
LED_O_C6  (via drill 0.3)
  Top 0.152: ORG_OUT.7 48.9,24.13 v48.9,26.99
  Bottom 0.152: v48.9,26.99 49.21,27.3 73.98,27.3 74.3,26.99 74.3,24.77 70.48,24.77 69.85,24.13 69.85,22.23 76.2,22.23 81.6,27.62 84.77,27.62 87.31,30.16 88.58,30.16 89.22,30.8 89.22,32.7 87.63,32.7 86.68,33.66 86.68,39.05 87,39.37 87,50.8 82.55,50.8 LED_O_2.3
LED_O_C7  (via drill 0.3)
  Top 0.152: ORG_OUT.8 49.53,24.77 v49.53,34.92 | v69.53,35.88 73.03,39.37 v73.03,46.35
  Bottom 0.152: v49.53,34.92 50.48,35.88 v69.53,35.88 | v73.03,46.35 73.98,47.31 81.28,47.31 82.23,48.26 LED_O_2.4
LED_O_C8  (via drill 0.3)
  Top 0.152: v63.5,19.37 LED_O_3.1
  Bottom 0.152: v63.5,19.37 61.28,21.59 57.47,21.59 56.83,22.23 54.61,22.23 ORG_OUT.9
LED_O_C9
  Top 0.152: LED_O_3.2 60.01,6.67 60.01,6.03 54.61,6.03 54.61,11.43 55.88,12.7 ORG_OUT.10
LED_O_C10
  Top 0.152: ORG_OUT.11 LED_O_3.3
LED_O_C11
  Top 0.152: LED_O_3.4 57.15,6.35 59.69,6.35 59.69,8.57 60.64,9.53 60.64,23.18 ORG_OUT.12
LED_O_C12
  Bottom 0.152: LED_O_4.1 42.55,26.04 43.5,25.08 46.67,25.08 47.62,26.04 58.42,26.04 58.74,26.35 65.09,26.35 67.31,24.13 67.31,22.54 66.99,22.54 66.67,22.23 64.77,22.23 ORG_OUT.13
LED_O_C13
  Bottom 0.152: LED_O_4.2 6.99,27.3 6.99,24.77 12.7,24.77 13.65,25.72 41.59,25.72 42.55,24.77 46.99,24.77 47.94,25.72 58.74,25.72 59.05,26.04 63.5,26.04 ORG_OUT.14
LED_O_C14
  Bottom 0.152: LED_O_4.3 6.99,32.38 1.91,32.38 0.95,31.43 0.95,17.46 6.35,17.46 6.67,17.78 13.65,17.78 15.24,19.37 45.09,19.37 45.72,18.73 64.14,18.73 68.58,23.18 ORG_OUT.15
LED_O_C15
  Bottom 0.152: LED_O_4.4 12.06,29.84 46.35,29.84 46.99,30.48 46.99,33.34 75.25,33.34 76.83,31.75 76.83,23.5 ORG_OUT.16
MUX1_S0  (via drill 0.3)
  Top 0.152: v44.45,66.04 44.45,68.58 POTS.10 | v40.64,66.04 40.64,48.58 40.96,48.26 40.96,39.05 TEENSY++.D7
  Bottom 0.152: v40.64,66.04 v44.45,66.04
MUX1_S1  (via drill 0.3)
  Top 0.152: v43.81,64.77 43.81,68.58 POTS.11 | v40.01,64.14 38.1,62.23 38.1,48.26 39.37,46.99 TEENSY++.D6
  Bottom 0.152: v43.81,64.77 43.18,64.14 v40.01,64.14
MUX1_S2  (via drill 0.3)
  Top 0.152: v41.59,42.23 43.18,43.81 43.18,53.98 43.81,54.61 43.81,61.28 POTS.14
  Bottom 0.152: v41.59,42.23 37.47,38.1 TEENSY++.D5
MUX1_S3
  Top 0.152: TEENSY++.D4 34.92,38.73 34.92,49.85 35.56,50.48 35.56,53.98 36.2,54.61 36.2,73.66 40.64,73.66 41.59,72.71 41.59,63.18 43.18,61.59 POTS.13
MUX1_SIG  (via drill 0.3)
  Top 0.152: v49.53,62.87 49.53,63.18 50.16,63.82 50.16,68.58 POTS.1 | v50.8,62.87 52.07,61.59 TEENSY++.F1
  Bottom 0.152: v50.8,62.87 v49.53,62.87
MUX2_S0
  Top 0.152: TEENSY++.C1 52.07,39.37 55.24,39.37 66.04,50.16 66.04,69.22 70.17,69.22 70.8,68.58 70.8,67.94 X.10
MUX2_S1  (via drill 0.3)
  Top 0.152: v55.88,37.15 55.88,39.05 68.58,51.75 68.58,68.9 69.85,68.9 70.17,68.58 70.17,67.94 X.11
  Bottom 0.152: v55.88,37.15 55.56,36.83 50.8,36.83 TEENSY++.C0
MUX2_S2  (via drill 0.3)
  Top 0.152: v70.17,44.13 70.17,60.33 X.14
  Bottom 0.152: v70.17,44.13 65.72,39.69 44.13,39.69 43.18,38.73 43.18,36.83 45.72,36.83 TEENSY++.E1
MUX2_S3  (via drill 0.3)
  Top 0.152: v69.53,39.05 69.53,60.33 X.13
  Bottom 0.152: v69.53,39.05 69.22,39.37 45.72,39.37 TEENSY++.E0
MUX2_SIG  (via drill 0.3)
  Top 0.152: v87.63,59.37 87.63,69.53 82.55,69.53 81.28,68.26 81.28,67.94 76.52,67.94 X.1
  Bottom 0.152: v87.63,59.37 83.19,54.93 81.92,54.93 79.06,52.07 55.88,52.07 TEENSY++.F2
MUX3_S0  (via drill 0.3)
  Top 0.152: v51.12,8.89 51.12,10.16 Y.10 | v62.23,9.21 61.59,9.84 61.59,19.68 62.23,20.32 TEENSY++.C5
  Bottom 0.152: v51.12,8.89 51.44,9.21 v62.23,9.21
MUX3_S1  (via drill 0.3)
  Top 0.152: v51.75,15.88 51.75,10.48 Y.11 | v59.05,16.83 59.37,17.14 v59.37,22.23 | TEENSY++.C4 v59.69,25.08
  Bottom 0.152: v51.75,15.88 52.7,16.83 v59.05,16.83 | v59.37,22.23 59.37,22.54 59.69,22.86 v59.69,25.08
MUX3_S2  (via drill 0.3)
  Top 0.152: v51.75,20.64 51.75,17.78 Y.14 | v56.52,21.59 57.15,22.23 TEENSY++.C3
  Bottom 0.152: v51.75,20.64 52.7,21.59 v56.52,21.59
MUX3_S3  (via drill 0.3)
  Top 0.152: v52.39,19.37 52.39,17.78 Y.13 | v53.66,19.68 54.61,20.64 TEENSY++.C2
  Bottom 0.152: v52.39,19.37 52.7,19.68 v53.66,19.68
MUX3_SIG  (via drill 0.3)
  Top 0.152: v46.99,13.97 45.4,12.38 45.4,10.48 Y.1 | v53.02,15.24 53.02,21.91 52.07,22.86 52.07,36.2 50.8,37.47 50.8,40.01 55.88,45.09 55.88,52.07 TEENSY++.F3
  Bottom 0.152: v46.99,13.97 48.26,15.24 v53.02,15.24
MUX4_S0  (via drill 0.3)
  Top 0.152: v26.67,55.56 26.67,64.45 25.08,64.45 23.5,62.87 23.5,61.59 21.91,61.59 18.1,65.41 18.1,66.99 BUTTONS.10
  Bottom 0.152: v26.67,55.56 28.89,53.34 TEENSY++.B3
MUX4_S1  (via drill 0.3)
  Top 0.152: v17.46,65.72 17.46,66.99 BUTTONS.11 | v31.11,64.14 31.75,63.5 TEENSY++.B2
  Bottom 0.152: v17.46,65.72 19.05,64.14 v31.11,64.14
MUX4_S2  (via drill 0.3)
  Top 0.152: v17.46,57.47 17.46,59.69 BUTTONS.14
  Bottom 0.152: v17.46,57.47 30.16,57.47 TEENSY++.B1
MUX4_S3  (via drill 0.3)
  Top 0.152: v16.83,58.1 16.83,59.69 BUTTONS.13
  Bottom 0.152: v16.83,58.1 21.91,58.1 22.23,57.78 32.38,57.78 TEENSY++.B0
MUX4_SIG
  Top 0.152: TEENSY++.F4 58.42,54.61 58.42,62.87 57.78,63.5 57.78,73.03 55.24,75.56 55.24,78.74 28.89,78.74 25.4,75.25 25.4,74.3 25.72,73.98 25.72,69.22 23.81,67.31 BUTTONS.1
POT_C0  (via drill 0.3)
  Top 0.152: v45.09,72.71 45.09,68.9 POTS.9
  Bottom 0.152: v45.09,72.71 46.04,73.66 66.36,73.66 66.99,74.3 POT_1.1
POT_C1  (via drill 0.3)
  Top 0.152: v45.72,70.8 45.72,68.9 POTS.8
  Bottom 0.152: v45.72,70.8 66.99,70.8 69.53,73.34 POT_1.2
POT_C2  (via drill 0.3)
  Top 0.152: v46.35,70.17 46.35,68.9 POTS.7
  Bottom 0.152: v46.35,70.17 46.67,70.48 69.85,70.48 71.75,72.39 POT_1.3
POT_C3  (via drill 0.3)
  Top 0.152: v52.07,74.61 46.99,69.53 46.99,68.9 POTS.6
  Bottom 0.152: v52.07,74.61 53.34,75.88 70.48,75.88 73.98,72.39 73.98,71.75 POT_1.4
POT_C4  (via drill 0.3)
  Top 0.152: v47.62,64.77 47.62,68.58 POTS.5 | v79.06,61.28 79.06,14.61 81.28,12.38 85.41,12.38 85.41,21.27 POT_2.1
  Bottom 0.152: v47.62,64.77 48.9,63.5 73.66,63.5 75.88,61.28 v79.06,61.28
POT_C5  (via drill 0.3)
  Top 0.152: v48.26,66.04 48.26,68.58 POTS.4 | v81.28,63.18 79.69,61.59 79.69,56.52 79.38,56.2 79.38,14.92 81.6,12.7 84.45,12.7 84.45,18.73 84.14,19.05 POT_2.2
  Bottom 0.152: v48.26,66.04 70.8,66.04 71.12,65.72 78.74,65.72 v81.28,63.18
POT_C6  (via drill 0.3)
  Top 0.152: v48.9,64.77 48.9,68.58 POTS.3 | v80.33,61.28 80.01,60.96 80.01,56.2 79.69,55.88 79.69,27.3 80.64,26.35 80.64,14.29 81.92,13.02 83.5,13.02 83.5,16.51 83.19,16.83 POT_2.3
  Bottom 0.152: v48.9,64.77 49.85,63.82 73.98,63.82 74.3,64.14 77.47,64.14 v80.33,61.28
POT_C7  (via drill 0.3)
  Top 0.152: v57.78,56.2 57.78,62.87 52.39,68.26 52.39,72.71 50.8,72.71 49.85,71.75 49.85,69.22 49.53,68.9 POTS.2 | v80.33,55.56 80.01,55.24 80.01,37.15 80.64,36.51 80.96,36.51 80.96,15.56 81.92,14.61 POT_2.4
  Bottom 0.152: v57.78,56.2 58.42,55.56 v80.33,55.56
POT_C8  (via drill 0.3)
  Top 0.152: v49.85,54.93 49.85,60.96 49.53,61.28 POTS.23 | v47.62,50.8 46.04,49.21 v46.04,42.23 | v29.84,34.92 30.16,34.61 30.16,5.4 POT_3.1
  Bottom 0.152: v49.85,54.93 50.8,53.98 50.8,52.07 48.9,52.07 v47.62,50.8 | v46.04,42.23 43.18,39.37 41.27,39.37 40.64,38.73 40.64,36.83 31.75,36.83 v29.84,34.92
POT_C9  (via drill 0.3)
  Top 0.152: v48.9,60.01 48.9,61.28 POTS.22 | v13.97,59.37 13.02,58.42 v13.02,9.21
  Bottom 0.152: v48.9,60.01 47.94,59.05 46.67,59.05 46.04,59.69 14.29,59.69 v13.97,59.37 | v13.02,9.21 15.88,6.35 21.27,6.35 22.54,5.08 26.35,5.08 26.67,5.4 POT_3.2
POT_C10  (via drill 0.3)
  Top 0.152: v48.26,49.21 48.26,61.28 POTS.21 | v31.11,40.01 30.48,39.37 30.48,3.81 29.84,3.17 24.77,3.17 24.77,6.35 POT_3.3
  Bottom 0.152: v48.26,49.21 46.35,47.31 38.42,47.31 v31.11,40.01
POT_C11  (via drill 0.3)
  Top 0.152: v47.62,59.69 47.62,61.28 POTS.20 | v13.02,59.37 12.38,58.74 v12.38,10.79
  Bottom 0.152: v47.62,59.69 46.67,59.69 46.35,60.01 13.65,60.01 v13.02,59.37 | v12.38,10.79 15.56,7.62 21.91,7.62 POT_3.4
POT_C12  (via drill 0.3)
  Top 0.152: v46.99,60.33 46.99,61.28 POTS.19
  Bottom 0.152: POT_4.1 v46.99,60.33
POT_C13  (via drill 0.3)
  Top 0.152: v46.35,62.87 46.35,61.59 POTS.18
  Bottom 0.152: v46.35,62.87 23.18,62.87 22.86,63.18 7.3,63.18 6.99,62.87 POT_4.2
POT_C14  (via drill 0.3)
  Top 0.152: v45.72,63.5 45.72,61.59 POTS.17
  Bottom 0.152: v45.72,63.5 9.21,63.5 7.94,64.77 POT_4.3
POT_C15  (via drill 0.3)
  Top 0.152: v45.09,67.31 45.09,61.59 POTS.16
  Bottom 0.152: v45.09,67.31 8.89,67.31 POT_4.4
SCL  (via drill 0.3)
  Top 0.152: I2C.2 15.88,5.4 15.88,9.84 R1.P$1 | TEENSY++.D0 24.45,37.78 v24.45,11.75
  Bottom 0.152: v24.45,11.75 24.13,11.43 17.46,11.43 16.19,10.16 R1.P$1
SDA
  Top 0.152: 18.73,8.89 18.73,5.4 I2C.1 | 18.73,8.89 18.73,9.84 R2.P$2 | TEENSY++.D1 27.62,37.15 27.62,10.79 28.26,10.16 28.26,9.53 26.67,7.94 23.5,7.94 22.54,8.89 18.73,8.89
X_C0  (via drill 0.3)
  Top 0.152: v71.44,66.36 71.44,67.63 X.9 | v54.29,67.63 52.7,69.22 52.7,76.2 X_1.1
  Bottom 0.152: v71.44,66.36 70.17,67.63 v54.29,67.63
X_C1
  Top 0.152: X_1.2 60.33,73.66 60.33,71.12 69.53,71.12 72.07,68.58 72.07,67.94 X.8
X_C2  (via drill 0.3)
  Top 0.152: v72.71,69.22 72.71,67.94 X.7
  Bottom 0.152: v72.71,69.22 73.66,70.17 74.61,70.17 75.56,71.12 75.56,76.2 60.33,76.2 X_1.3
X_C3
  Top 0.152: X_1.4 62.87,76.2 62.87,71.44 71.44,71.44 73.34,69.53 73.34,67.94 X.6
X_C4  (via drill 0.3)
  Top 0.152: v73.98,66.36 73.98,67.63 X.5
  Bottom 0.152: v73.98,66.36 74.3,66.67 83.19,66.67 83.5,66.99 84.45,66.99 89.53,61.91 89.53,34.29 88.27,34.29 X_2.1
X_C5  (via drill 0.3)
  Top 0.152: v74.61,63.5 74.61,67.63 X.4 | v77.15,61.91 77.79,61.28 v77.79,41.91
  Bottom 0.152: v74.61,63.5 76.2,61.91 v77.15,61.91 | v77.79,41.91 87.95,31.75 X_2.2
X_C6  (via drill 0.3)
  Top 0.152: v90.49,28.89 90.49,68.9 arc90 89.22,70.17 76.83,70.17 75.25,68.58 75.25,67.94 X.3
  Bottom 0.152: v90.49,28.89 88.27,28.89 X_2.3
X_C7
  Top 0.152: X.2 75.88,67.94 75.88,68.58 77.15,69.85 88.9,69.85 arc-90 90.17,68.58 90.17,29.53 89.85,29.21 89.85,25.08 89.22,24.45 88.27,24.45 88.27,26.35 X_2.4
X_C8  (via drill 0.3)
  Top 0.152: v75.88,64.77 75.88,60.64 X.23 | v70.17,64.45 68.9,63.18 68.9,35.24 72.39,31.75 72.39,22.86 71.75,22.23 v71.75,9.84
  Bottom 0.152: v75.88,64.77 75.56,64.45 v70.17,64.45 | v71.75,9.84 72.71,8.89 80.96,8.89 83.19,6.67 83.19,2.22 arc-90 81.92,0.95 43.5,0.95 X_3.1
X_C9  (via drill 0.3)
  Top 0.152: v73.66,32.07 73.66,57.15 75.25,58.74 75.25,60.33 X.22 | v45.09,27.62 44.45,26.99 44.45,18.41 40.64,14.61 40.64,3.81 X_3.2
  Bottom 0.152: v73.66,32.07 75.56,30.16 76.2,30.16 76.52,29.84 76.52,27.62 v45.09,27.62
X_C10  (via drill 0.3)
  Top 0.152: v72.71,48.58 72.71,56.83 74.61,58.74 74.61,60.33 X.21 | v37.47,43.5 35.56,41.59 35.56,35.24 34.29,33.97 34.29,9.53 33.02,8.26 33.02,1.91 33.66,1.27 36.83,1.27 X_3.3
  Bottom 0.152: v72.71,48.58 71.12,46.99 44.77,46.99 41.27,43.5 v37.47,43.5
X_C11  (via drill 0.3)
  Top 0.152: v73.98,65.09 73.98,60.64 X.20 | v81.28,37.47 v81.28,61.91 | v36.83,32.07 36.83,9.53 35.56,8.26 35.56,3.81 X_3.4
  Bottom 0.152: v73.98,65.09 74.3,65.41 77.79,65.41 v81.28,61.91 | v81.28,37.47 80.33,36.51 65.72,36.51 65.41,36.2 40.96,36.2 v36.83,32.07
X_C12  (via drill 0.3)
  Top 0.152: v71.75,50.8 71.75,57.47 73.34,59.05 73.34,60.33 X.19
  Bottom 0.152: v71.75,50.8 70.8,49.85 40.32,49.85 38.1,47.62 8.89,47.62 8.26,46.99 3.81,46.99 X_4.1
X_C13  (via drill 0.3)
  Top 0.152: v71.75,48.58 71.12,49.21 71.12,59.37 72.39,59.37 72.71,59.69 72.71,60.33 X.18
  Bottom 0.152: v71.75,48.58 72.71,49.53 72.71,51.44 51.75,51.44 50.48,50.16 40.01,50.16 39.05,49.21 8.57,49.21 8.26,49.53 6.99,49.53 5.71,50.8 X_4.2
X_C14  (via drill 0.3)
  Top 0.152: v72.07,62.55 72.07,60.64 X.17 | X_4.3 v10.16,60.96
  Bottom 0.152: v72.07,62.55 72.07,60.64 47.62,60.64 47.31,60.96 v10.16,60.96
X_C15  (via drill 0.3)
  Top 0.152: v71.44,61.91 71.44,60.64 X.16 | v8.26,60.96 3.17,55.88 X_4.4
  Bottom 0.152: v71.44,61.91 71.12,62.23 23.18,62.23 22.54,62.87 10.16,62.87 v8.26,60.96
Y_C0  (via drill 0.3)
  Top 0.152: v50.48,15.88 50.48,10.48 Y.9 | v5.08,13.65 2.54,13.65 arc-90 1.27,14.92 1.27,61.91 v16.83,77.47
  Bottom 0.152: v50.48,15.88 50.16,15.56 7.94,15.56 7.62,15.24 7.3,15.24 5.71,13.65 v5.08,13.65 | Y_1.1 v16.83,77.47
Y_C1  (via drill 0.3)
  Top 0.152: v44.45,8.26 48.58,8.26 49.85,9.53 49.85,10.16 Y.8 | v11.75,12.06 11.11,12.7 11.11,51.44 11.75,52.07 11.75,67.63 v22.86,78.74
  Bottom 0.152: v44.45,8.26 40.32,12.38 12.06,12.38 v11.75,12.06 | v22.86,78.74 33.66,78.74 Y_1.2
Y_C2  (via drill 0.3)
  Top 0.152: v45.09,14.61 47.31,14.61 49.21,12.7 49.21,10.48 Y.7 | v11.75,14.92 12.06,15.24 12.06,66.99 v21.27,76.2
  Bottom 0.152: v45.09,14.61 44.77,14.92 v11.75,14.92 | v21.27,76.2 36.2,76.2 Y_1.3
Y_C3  (via drill 0.3)
  Top 0.152: v48.58,12.38 48.58,10.48 Y.6
  Bottom 0.152: v48.58,12.38 48.26,12.7 5.08,12.7 0.64,17.14 0.64,77.15 arc-90 1.91,78.42 21.59,78.42 22.54,79.38 38.1,79.38 Y_1.4
Y_C4  (via drill 0.3)
  Top 0.152: v47.94,11.75 47.94,10.48 Y.5 | v73.03,21.59 73.03,29.21 74.3,30.48 v74.3,47.94
  Bottom 0.152: v47.94,11.75 48.26,11.43 62.87,11.43 v73.03,21.59 | v74.3,47.94 77.79,51.44 80.96,51.44 81.92,52.39 84.45,52.39 87.95,55.88 Y_2.1
Y_C5  (via drill 0.3)
  Top 0.152: v47.31,8.89 47.31,10.16 Y.4 | v85.09,10.16 86.68,11.75 86.68,32.07 87.31,32.7 89.53,32.7 89.53,48.9 88.58,49.85 87,49.85 87,51.75 87.95,52.7 87.95,53.34 Y_2.2
  Bottom 0.152: v47.31,8.89 48.9,10.48 83.82,10.48 84.14,10.16 v85.09,10.16
Y_C6  (via drill 0.3)
  Top 0.152: v46.67,11.75 46.67,10.48 Y.3 | v88.9,25.08 89.53,25.72 89.53,32.07 89.85,32.38 89.85,49.21 88.27,50.8 Y_2.3
  Bottom 0.152: v46.67,11.75 47.31,11.11 72.71,11.11 86.68,25.08 v88.9,25.08
Y_C7  (via drill 0.3)
  Top 0.152: v46.04,8.89 46.04,10.16 Y.2 | v84.45,10.79 86.36,12.7 86.36,34.29 87.95,35.88 87.95,48.26 Y_2.4
  Bottom 0.152: v46.04,8.89 47.94,10.79 v84.45,10.79
Y_C8  (via drill 0.3)
  Top 0.152: v46.04,19.37 46.04,17.78 Y.23 | v61.28,20.32 61.28,9.21 62.23,8.26 62.23,3.81 Y_3.1
  Bottom 0.152: v46.04,19.37 46.35,19.05 51.12,19.05 52.39,20.32 v61.28,20.32
Y_C9  (via drill 0.3)
  Top 0.152: v49.85,12.7 46.67,15.88 46.67,17.46 Y.22 | v54.29,12.06 54.29,5.71 55.88,4.13 60.96,4.13 Y_3.2
  Bottom 0.152: v49.85,12.7 50.48,12.06 v54.29,12.06
Y_C10  (via drill 0.3)
  Top 0.152: v48.9,14.61 47.31,16.19 47.31,17.46 Y.21 | v53.98,13.65 53.66,13.34 53.66,5.71 55.56,3.81 58.42,3.81 Y_3.3
  Bottom 0.152: v48.9,14.61 49.85,13.65 v53.98,13.65
Y_C11  (via drill 0.3)
  Top 0.152: v49.85,14.61 47.94,16.51 47.94,17.46 Y.20 | v53.02,14.29 53.34,13.97 53.34,5.08 Y_3.4
  Bottom 0.152: v49.85,14.61 50.16,14.29 v53.02,14.29
Y_C12  (via drill 0.3)
  Top 0.152: v48.58,21.91 48.58,17.78 Y.19
  Bottom 0.152: v48.58,21.91 6.99,21.91 2.86,26.04 Y_4.1
Y_C13  (via drill 0.3)
  Top 0.152: v49.21,20.95 49.21,17.78 Y.18 | v9.21,21.27 6.35,24.13 6.35,24.77 Y_4.2
  Bottom 0.152: v49.21,20.95 48.9,21.27 v9.21,21.27
Y_C14  (via drill 0.3)
  Top 0.152: v49.85,20.32 49.85,17.78 Y.17
  Bottom 0.152: v49.85,20.32 7.94,20.32 3.49,24.77 1.91,24.77 1.27,25.4 1.27,31.11 Y_4.3
Y_C15  (via drill 0.3)
  Top 0.152: v50.48,19.68 50.48,17.78 Y.16 | v10.16,19.68 10.48,20 10.48,30.8 8.89,32.38 2.54,32.38 Y_4.4
  Bottom 0.152: v50.48,19.68 46.67,19.68 46.35,20 10.48,20 v10.16,19.68

### Text on the board
bPlace: ENCODER | BLUE | B | C | A | 0 | 1 | 2 | 3 | 4 | 5 | 6 | 7 | 8 | 9 | 10 | 11 | 12 | 13 | 14 | 15 | ORANGE | R | G | BU | (-) | ENC CTRL | 0 | 1 | 2 | 3 | 4 | 5 | 6 | 7 | 8 | 9 | 10 | 11 | 12 | 13 | 14 | 15 | 5V IN | I2C | 5V OUT
tNames: (0) | (1) | (2) | (3) | (0) | (1) | (2) | (3) | (3) | (+) | (-) | (0) | (2) | (1) | (1) | (0) | (1) | (2) | (3) | (2) | (0) | (0) | (1) | (2) | (3) | (3) | (4) | (15) | (5) | (14) | (6) | (13) | (7) | (12) | (15) | (15) | (4) | (4) | 5V | R | G | P Sig | X Sig | Y Sig | Button Sig | (5) | (5) | (14) | (14) | (13) | (13) | (6) | (6) | (12) | (12) | (7) | (7) | (-) | (+) | (-) | (+) | (15) | (15) | SCL | SDA | (4) | (4) | (5) | (5) | (14) | (14) | (13) | (13) | B | C | A | 0 | 1 | 2 | 3 | 4 | 5 | 6 | 7 | 8 | 9 | 10 | 11 | 12 | 13 | 14 | 15 | (6) | (6) | (12) | (12) | (7) | (7) | R | G | BU | (-) | 0 | 1 | 2 | 3 | 4 | 5 | 6 | 7 | 8 | 9 | 10 | 11 | 12 | 13 | 14 | 15 | (4) | (15) | (14) | (5) | (13) | (6) | (12) | (7) | (-) | (+) | SCL | SDA | (-) | (+) | (11) | (11) | (10) | (9) | (8) | (-) | (+) | (11) | (10) | (9) | (8) | (8) | (9) | (10) | (9) | (10) | 5V IN | (8) | (11) | (11) | (10) | (9) | (8) | (11) | (10) | (9) | (8) | 5V OUT